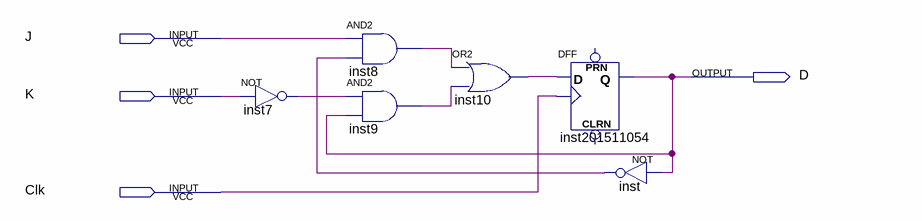
[diagram p0: schematic sheet]
// Quartus schematic lab05_2.bdf as structural Verilog: 6 symbols, 4 pins
module lab05_2 (
  input  J,
  input  K,
  input  Clk,
  output D
);

  wire inst7_out, inst8_out, inst9_out, inst10_out, inst_out;

  not inst7 (inst7_out, K);
  and inst8 (inst8_out, J, inst_out);
  and inst9 (inst9_out, inst7_out, D);
  or inst10 (inst10_out, inst8_out, inst9_out);
  DFF inst201511054 (.CLK(Clk), .D(inst10_out), .Q(D));  // open: CLRN, PRN
  not inst (inst_out, D);
endmodule
